# EAGLE schematic Thermocouple_Module (EAGLE 9.5.1)
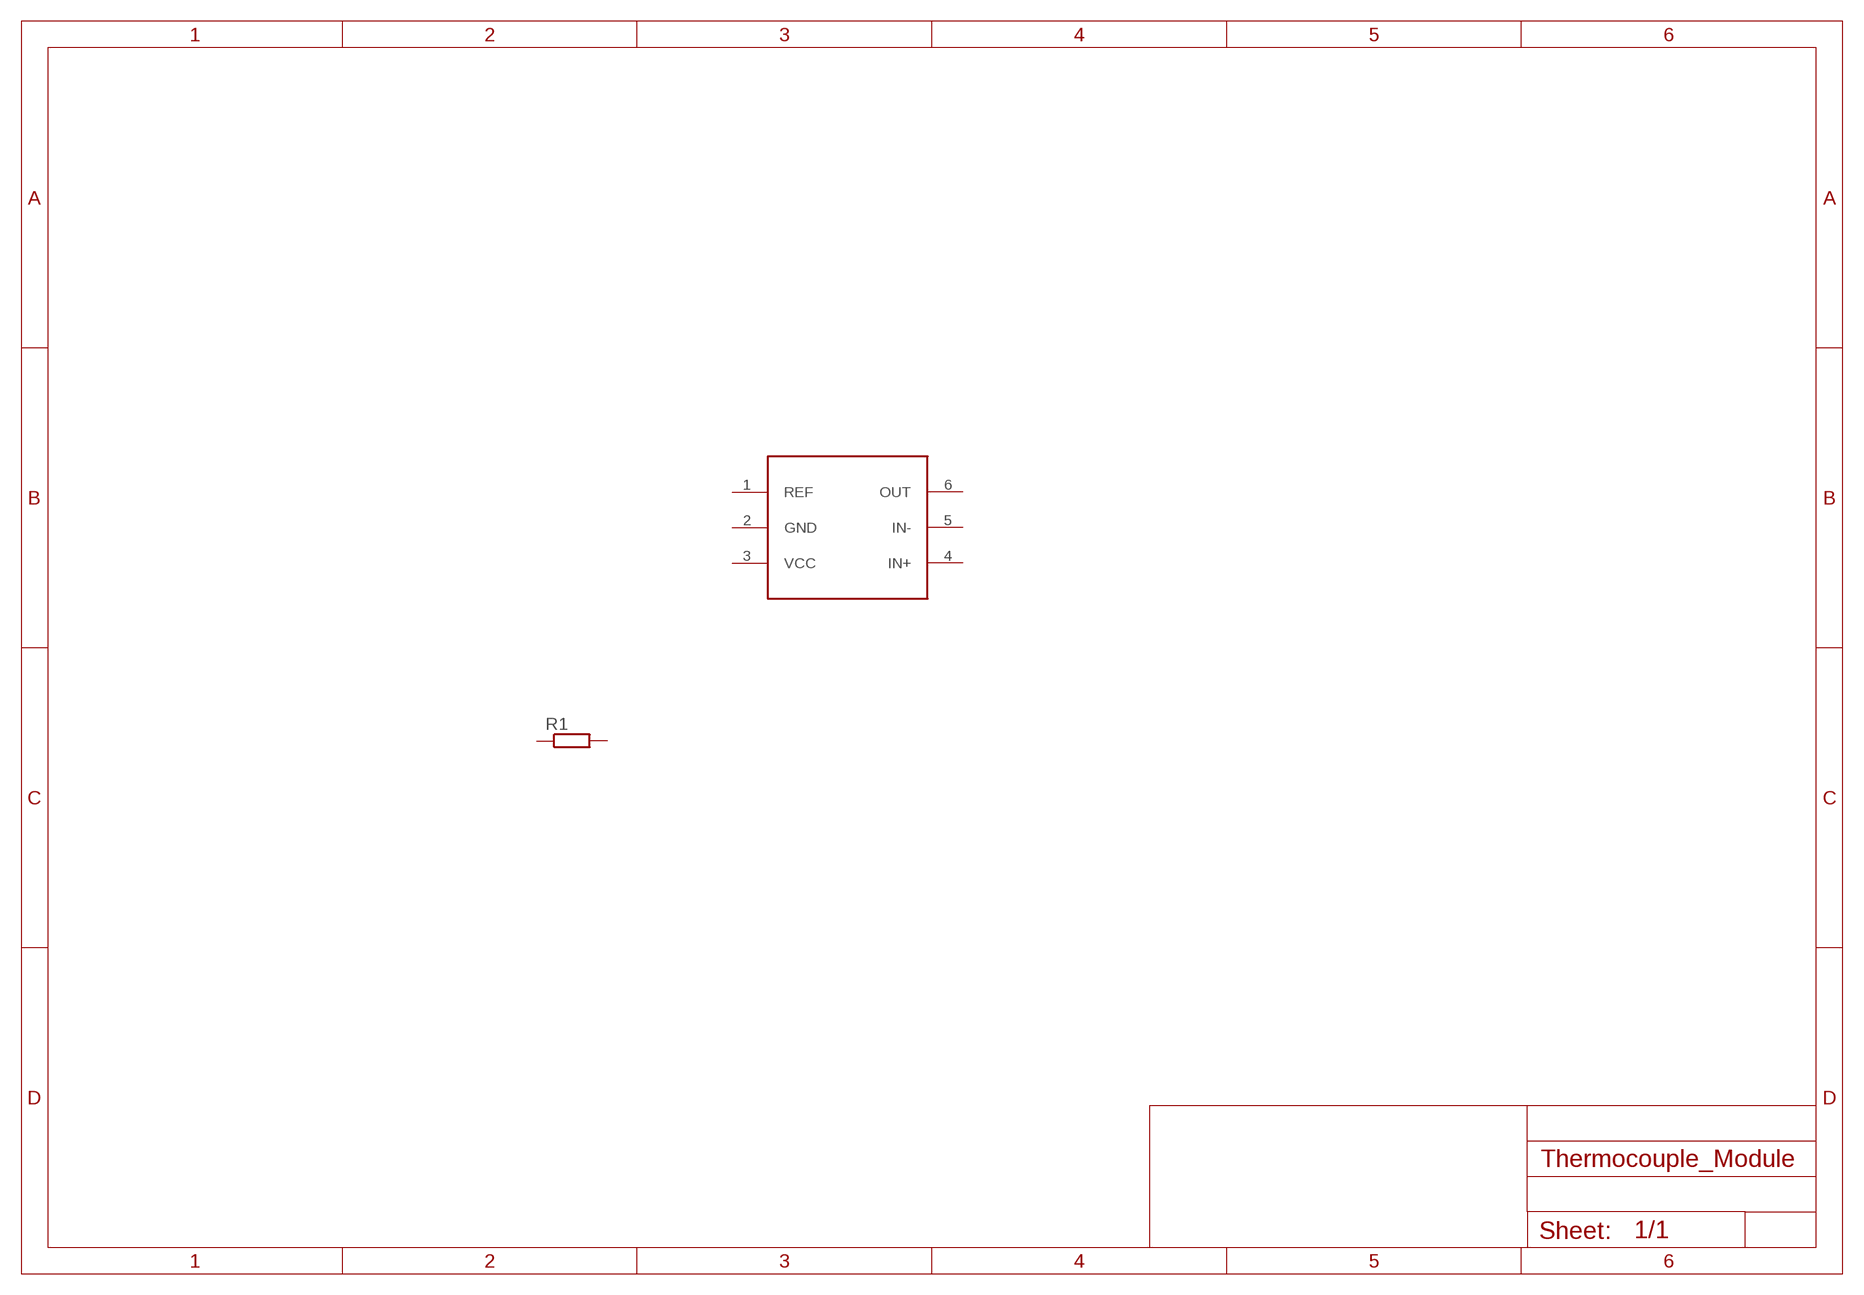
[diagram p0: schematic, sheet 1]

## Parts
R1  R-EU_0204/7  [0204/7]
U1  INA213  [SC-70-6]
Unconnected: R1.1 R1.2 U1.1(REF) U1.2(GND) U1.3(VCC) U1.4(IN+) U1.5(IN-) U1.6(OUT)

## Library data of the parts
R1 = rcl:R-EU_: RESISTOR, European symbol; SPICEPREFIX: R
U1 = texas:INA213: 26V, Bi-Directional, Zero-Drift, Low-/High-Side, Voltage Output Current Sense Amplifier Source: Data sheet <http://www.ti.com/lit/ds/symlink/ina213.pdf>